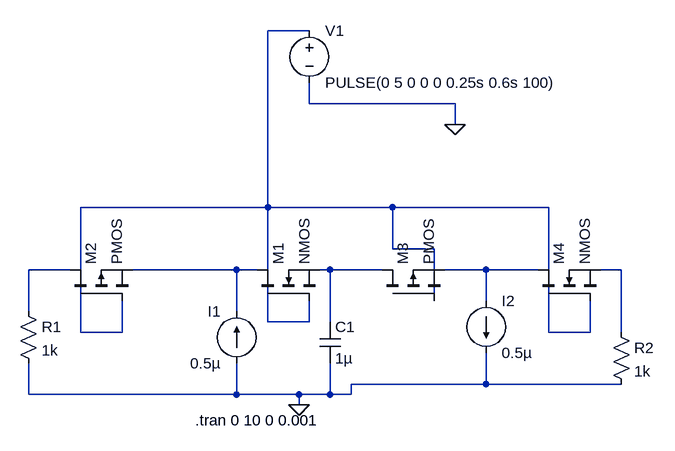
[diagram p0: schematic Draft9.asc]
Draft9.asc, the LTspice schematic file:
Version 4
SHEET 1 880 752
WIRE 272 -304 208 -304
WIRE 272 -192 272 -224
WIRE 496 -192 272 -192
WIRE 496 -160 496 -192
WIRE 208 -32 208 -304
WIRE 208 -32 -80 -32
WIRE 400 -32 208 -32
WIRE 640 -32 400 -32
WIRE 400 32 400 -32
WIRE 464 32 400 32
WIRE -96 64 -160 64
WIRE 160 64 0 64
WIRE 192 64 160 64
WIRE 304 64 288 64
WIRE 384 64 304 64
WIRE 544 64 480 64
WIRE 624 64 544 64
WIRE 752 64 720 64
WIRE 464 112 464 32
WIRE 544 112 544 64
WIRE -160 128 -160 64
WIRE 160 128 160 64
WIRE 208 144 208 -32
WIRE 272 144 272 112
WIRE 272 144 208 144
WIRE 304 144 304 64
WIRE -80 160 -80 -32
WIRE -16 160 -16 112
WIRE -16 160 -80 160
WIRE 640 160 640 -32
WIRE 704 160 704 112
WIRE 704 160 640 160
WIRE 752 160 752 64
WIRE 544 240 544 192
WIRE 544 240 336 240
WIRE 752 240 544 240
WIRE -160 256 -160 208
WIRE 160 256 160 208
WIRE 160 256 -160 256
WIRE 256 256 160 256
WIRE 304 256 304 208
WIRE 304 256 256 256
WIRE 336 256 336 240
WIRE 336 256 304 256
WIRE 256 272 256 256
FLAG 256 272 0
FLAG 496 -160 0
SYMBOL current 160 208 R180
WINDOW 0 24 80 Left 2
WINDOW 3 24 0 Left 2
WINDOW 123 0 0 Left 0
WINDOW 39 0 0 Left 0
SYMATTR InstName I1
SYMATTR Value 0.5µ
SYMBOL cap 288 144 R0
SYMATTR InstName C1
SYMATTR Value 1µ
SYMBOL nmos 192 112 R270
SYMATTR InstName M1
SYMBOL pmos -96 112 R270
SYMATTR InstName M2
SYMBOL res -176 112 R0
SYMATTR InstName R1
SYMATTR Value 1k
SYMBOL current 544 112 R0
WINDOW 123 0 0 Left 0
WINDOW 39 0 0 Left 0
SYMATTR InstName I2
SYMATTR Value 0.5µ
SYMBOL res 736 144 R0
SYMATTR InstName R2
SYMATTR Value 1k
SYMBOL voltage 272 -320 R0
WINDOW 123 0 0 Left 0
WINDOW 39 0 0 Left 0
SYMATTR InstName V1
SYMATTR Value PULSE(0 5 0 0 0 0.25s 0.6s 100)
SYMBOL pmos 384 112 R270
SYMATTR InstName M3
SYMBOL nmos 624 112 R270
SYMATTR InstName M4
TEXT 96 296 Left 2 !.tran 0 10 0 0.001

The netlist it stands for:
* Draft9.asc
I1 0 N003 0.5µ
C1 N004 0 1µ
M1 N003 N001 N004 N004 NMOS
M2 N002 N001 N003 N003 PMOS
R1 N002 0 1k
I2 N005 0 0.5µ
R2 N006 0 1k
V1 N001 0 PULSE(0 5 0 0 0 0.25s 0.6s 100)
M3 N004 N001 N005 N005 PMOS
M4 N005 N001 N006 N006 NMOS
.model NMOS NMOS
.model PMOS PMOS
.lib standard.mos
.tran 0 10 0 0.001
.backanno
.end